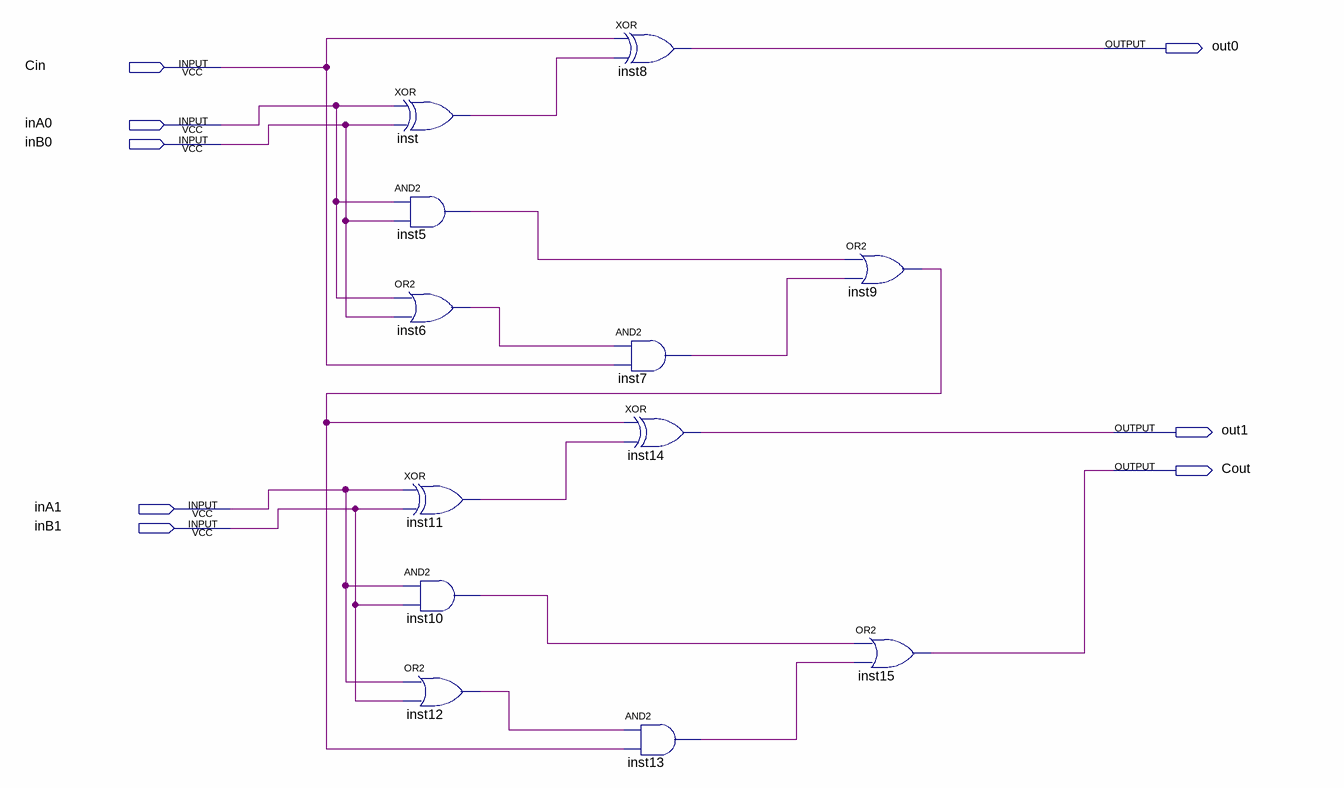
[diagram p0: schematic sheet]
// Quartus schematic somador.bdf as structural Verilog: 12 symbols, 8 pins
module somador (
  input  Cin,
  input  inA0,
  input  inB0,
  input  inA1,
  input  inB1,
  output out0,
  output out1,
  output Cout
);

  wire inst5_out, inst6_out, inst7_out, inst9_out, inst10_out, inst11_out, inst12_out, inst13_out, inst_out;

  xor inst (inst_out, inA0, inB0);
  and inst5 (inst5_out, inA0, inB0);
  or inst6 (inst6_out, inA0, inB0);
  xor inst11 (inst11_out, inA1, inB1);
  and inst10 (inst10_out, inA1, inB1);
  or inst12 (inst12_out, inA1, inB1);
  xor inst8 (out0, Cin, inst_out);
  and inst7 (inst7_out, inst6_out, Cin);
  xor inst14 (out1, inst9_out, inst11_out);
  and inst13 (inst13_out, inst12_out, inst9_out);
  or inst9 (inst9_out, inst5_out, inst7_out);
  or inst15 (Cout, inst10_out, inst13_out);
endmodule
